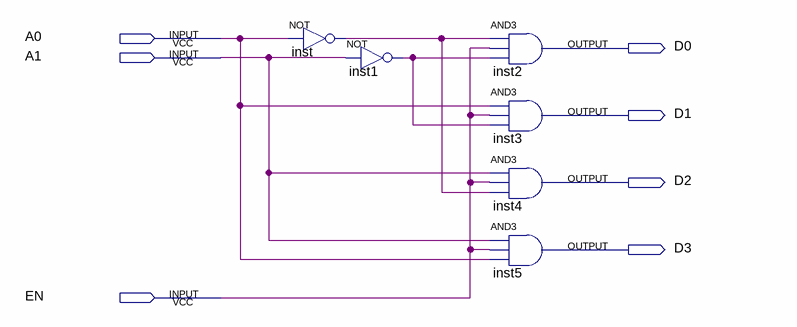
[diagram p0: schematic sheet]
// Quartus schematic 2to4_en.bdf as structural Verilog: 6 symbols, 7 pins
module \2to4_en  (
  input  A0,
  input  A1,
  input  EN,
  output D0,
  output D1,
  output D2,
  output D3
);

  wire inst1_out, inst_out;

  not inst (inst_out, A0);
  not inst1 (inst1_out, A1);
  and inst2 (D0, inst_out, EN, inst1_out);
  and inst3 (D1, A0, EN, inst1_out);
  and inst4 (D2, A1, EN, inst_out);
  and inst5 (D3, A1, EN, A0);
endmodule
